# EAGLE design charger_4012 (EAGLE 7.5.0)
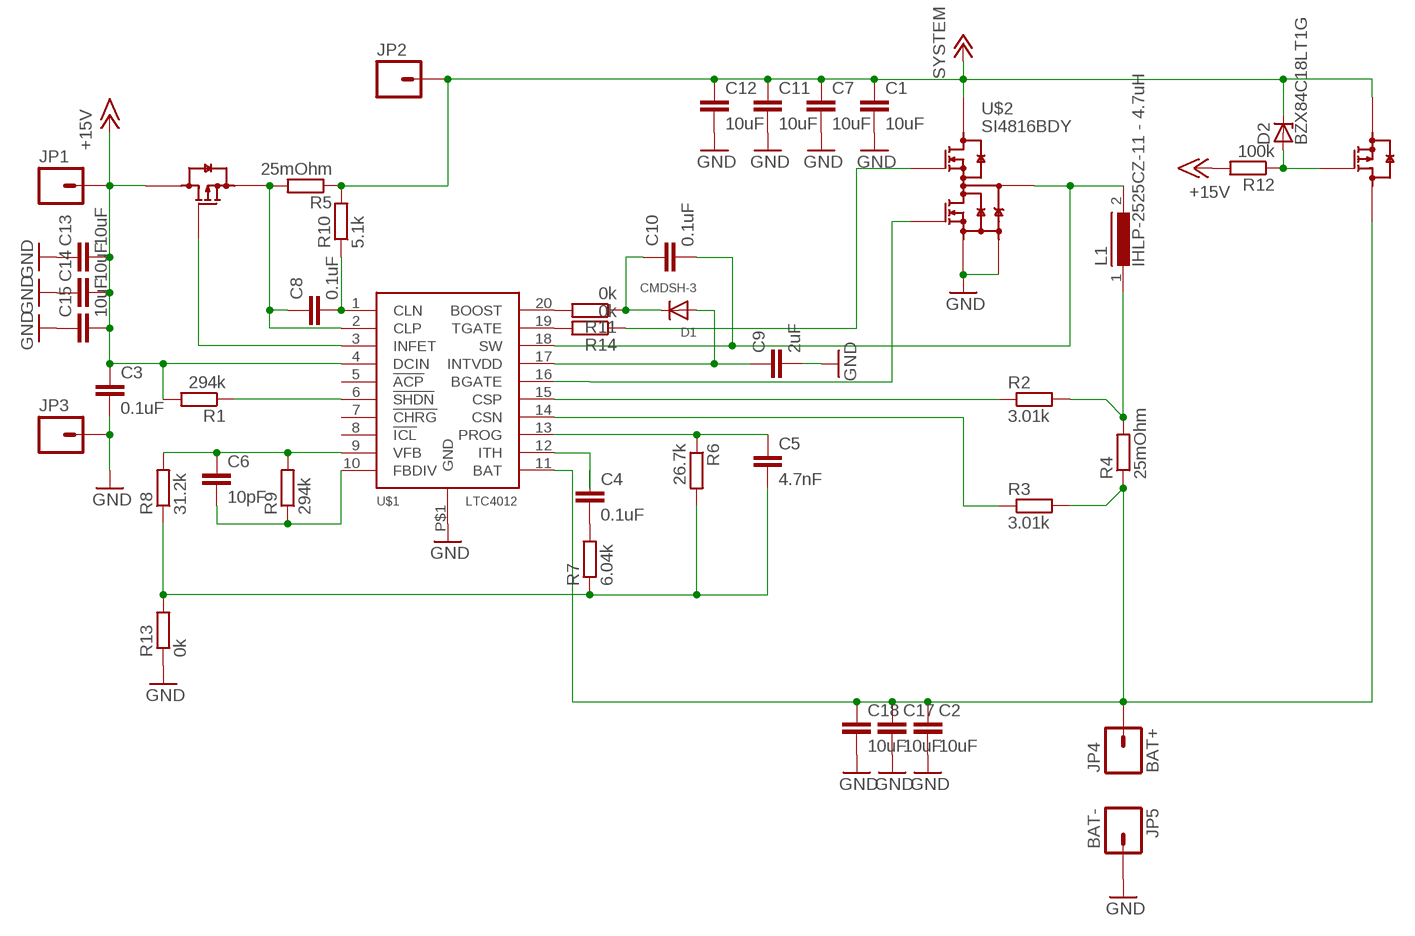
[diagram p0: schematic, sheet 1]

## Parts
C1  10uF  C-EUC1206  [C1206]
C2  10uF  C-EUC1206  [C1206]
C3  0.1uF  C-EUC0402  [C0402]
C4  0.1uF  C-EUC0402  [C0402]
C5  4.7nF  C-EUC0402  [C0402]
C6  10pF  C-EUC0402  [C0402]
C7  10uF  C-EUC1206  [C1206]
C8  0.1uF  C-EUC0402  [C0402]
C9  2uF  C-EUC0805  [C0805]
C10  0.1uF  C-EUC0402  [C0402]
C11  10uF  C-EUC1206  [C1206]
C12  10uF  C-EUC1206  [C1206]
C13  10uF  C-EUC1206  [C1206]
C14  10uF  C-EUC1206  [C1206]
C15  10uF  C-EUC1206  [C1206]
C17  10uF  C-EUC1206  [C1206]
C18  10uF  C-EUC1206  [C1206]
D1  CMDSH-3  DIODESOD-323F  [SOD-323F]
D2  BZX84C18LT1G  ZENER-DIODETO236  [TO236]
JP1  M01PTH_2MM  [1X01_2MM]
JP2  M01PTH_2MM  [1X01_2MM]
JP3  M01PTH_2MM  [1X01_2MM]
JP4  BAT+  M01PTH_2MM  [1X01_2MM]
JP5  BAT-  M01PTH_2MM  [1X01_2MM]
L1  IHLP-2525CZ-11 - 4.7uH  DR73  [DR73]
R1  294k  R-EU_R0402  [R0402]
R2  3.01k  R-EU_R0402  [R0402]
R3  3.01k  R-EU_R0402  [R0402]
R4  25mOhm  R-EU_R2512  [R2512]
R5  25mOhm  R-EU_R2512  [R2512]
R6  26.7k  R-EU_R0402  [R0402]
R7  6.04k  R-EU_R0402  [R0402]
R8  31.2k  R-EU_R0402  [R0402]
R9  294k  R-EU_R0402  [R0402]
R10  5.1k  R-EU_R0402  [R0402]
R11  0k  R-EU_R0402  [R0402]
R12  100k  R-EU_R0402  [R0402]
R13  0k  R-EU_R0402  [R0402]
R14  0k  R-EU_R0402  [R0402]
U$1  LTC4012  [QFN20]
U$2  SI4816BDY  [SO-8]
U$3  SI7423DN  [POWERPACK1212]
U$4  SI7423DN  [POWERPACK1212]

## Nets
+12V: C1.1 C7.1 C11.1 C12.1 D2.C JP2.1 R5.1 R10.2 U$2.8(D1) U$4.1(S) U$4.2(S) U$4.3(S) ; supply symbol labelled SYSTEM
+15V: C3.1 C13.2 C14.2 C15.2 JP1.1 R1.2 R12.2 U$1.4(DCIN) U$3.5(D) U$3.6(D) U$3.7(D) U$3.8(D) U$3.9(D)
BAT: C2.1 C17.1 C18.1 JP4.1 R3.2 R4.1 U$1.11(BAT) U$4.5(D) U$4.6(D) U$4.7(D) U$4.8(D) U$4.9(D)
BGATE: U$1.16(BGATE) U$2.4(G2)
BOOST: C10.1 D1.C R11.1
CLN: C8.2 R10.1 U$1.1(CLN)
CSN: R3.1 U$1.14(CSN)
CSP: R2.1 U$1.15(CSP)
FBDIV: C6.2 R9.1 U$1.10(FBDIV)
GND: C1.2 C2.2 C3.2 C7.2 C9.2 C11.2 C12.2 C13.1 C14.1 C15.1 C17.2 C18.2 JP3.1 JP5.1 R13.1 U$1.P$1(GND) U$2.2(A) U$2.3(S2)
INFET: U$1.3(INFET) U$3.4(G)
INTVDD: C9.1 D1.A U$1.17(INTVDD)
ITH: C4.1 U$1.12(ITH)
N$1: R14.2 U$1.19(TGATE)
N$3: L1.1 R2.2 R4.2
N$7: C4.2 R7.2
N$8: R1.1 U$1.6(!SHDN)
N$15: C8.1 R5.2 U$1.2(CLP) U$3.1(S) U$3.2(S) U$3.3(S)
N$18: R11.2 U$1.20(BOOST)
N$20: D2.A R12.1 U$4.4(G)
PROG: C5.1 R6.1 U$1.13(PROG)
SGND: C5.2 R6.2 R7.1 R8.1 R13.2
SW: C10.2 L1.2 U$1.18(SW) U$2.5(S1/D2) U$2.6(S1/D2) U$2.7(S1/D2)
TGATE: R14.1 U$2.1(G1)
VFB: C6.1 R8.2 R9.2 U$1.9(VFB)
Unconnected: U$1.5(!ACP) U$1.7(!CHRG) U$1.8(!ICL)

## Library data of the parts
C1-C15 C17 C18 = resistor:C-EU: CAPACITOR, European symbol
D1 = adafruit:DIODE: Diode SMADIODE - SMA Surface Mount Package 20V 1A Schottky Diode Digikey: 641-1014-6-ND DO-1N4148 - Through Hole Small Current Diode SOD-123 20V 1 A (.5mV Vf) Schottky Diode - Digikey: MBRX120TPMSCT-ND SOD-323 10V 570mA (.38mV Vf, 3ns) Schottky Diode - Digikey: ZLLS410CT-ND SOD-523 30V 30mA Schottky Diode (RB751S-40TE61) - Digikey: RB751S-40TE61CT-ND SOT23-R/W - SOT23 Package (R = Solder Paste/Reflow Ovens, W = Hand-Soldering) BAT54Film 40V 300mA - Digikey: 497-7162-1-ND
D2 = diode:ZENER-DIODE: Z-Diode
JP1-JP5 = SparkFun-Connectors:M01: Header 1 Standard 1-pin 0.1" header. Use with straight break away headers (SKU : PRT-00116), right angle break away headers (PRT-00553), swiss pins (PRT-00743), machine pins (PRT-00117), and female headers (PRT-00115).
L1 = inductors:DR73: High Power Density, High Efficiency, Shielded Inductors Source: coiltronics_dr_series.pdf
R1-R14 = resistor:R-EU_: RESISTOR, European symbol
U$1 = ltc4012:LTC4012
U$2 = vishay:SI4816BDY
U$3 U$4 = vishay:SI7423DN

## Net classes
0 default: width 0.25 mm, drill 0.5 mm, clearance 0.15 mm

## Board
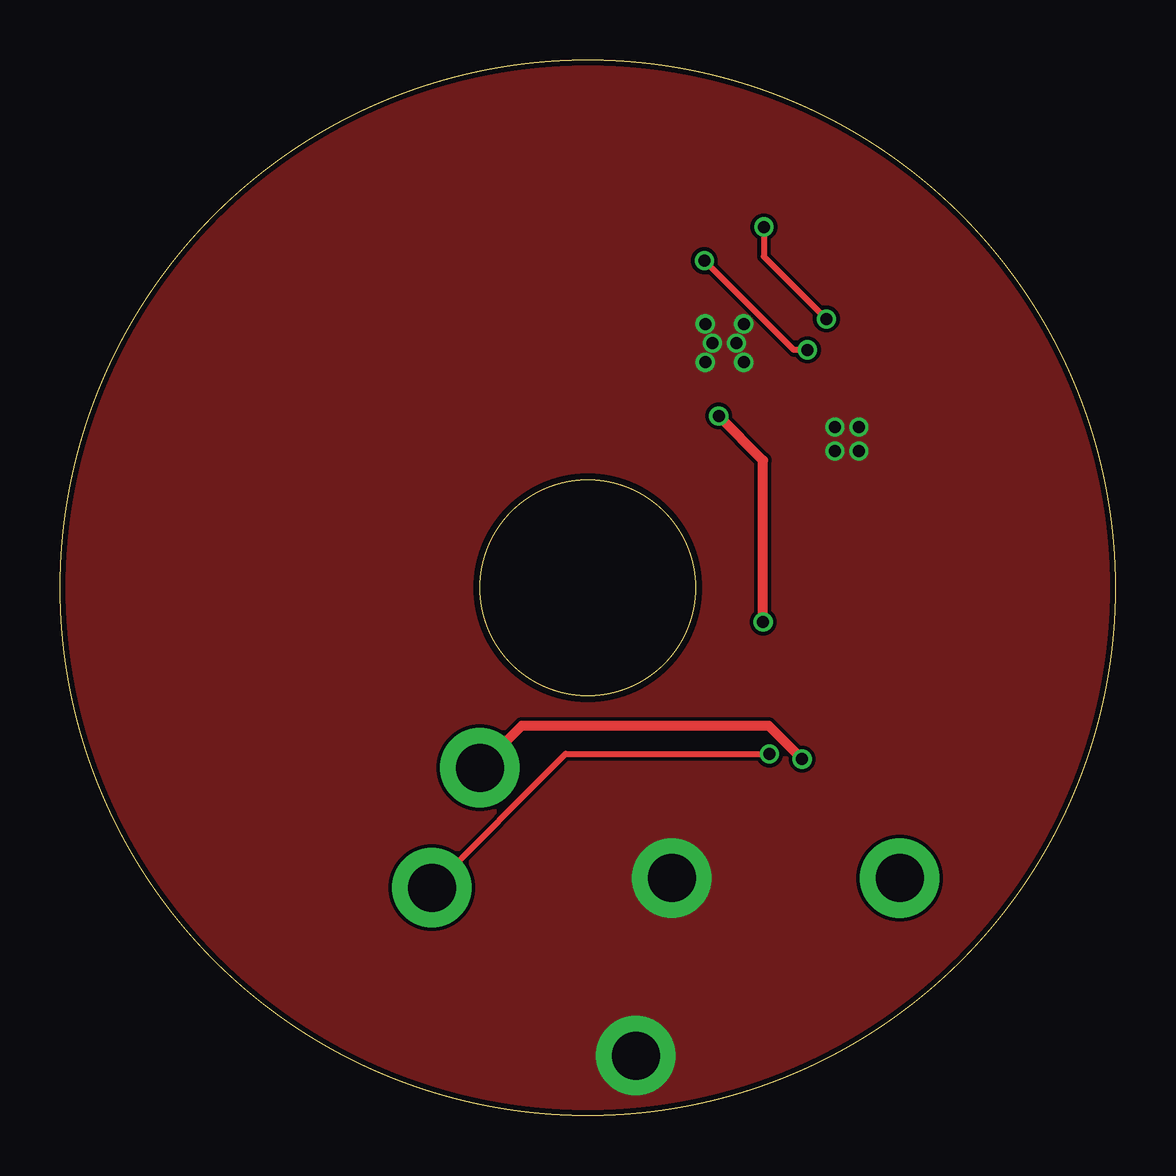
[diagram p1: board, top side]
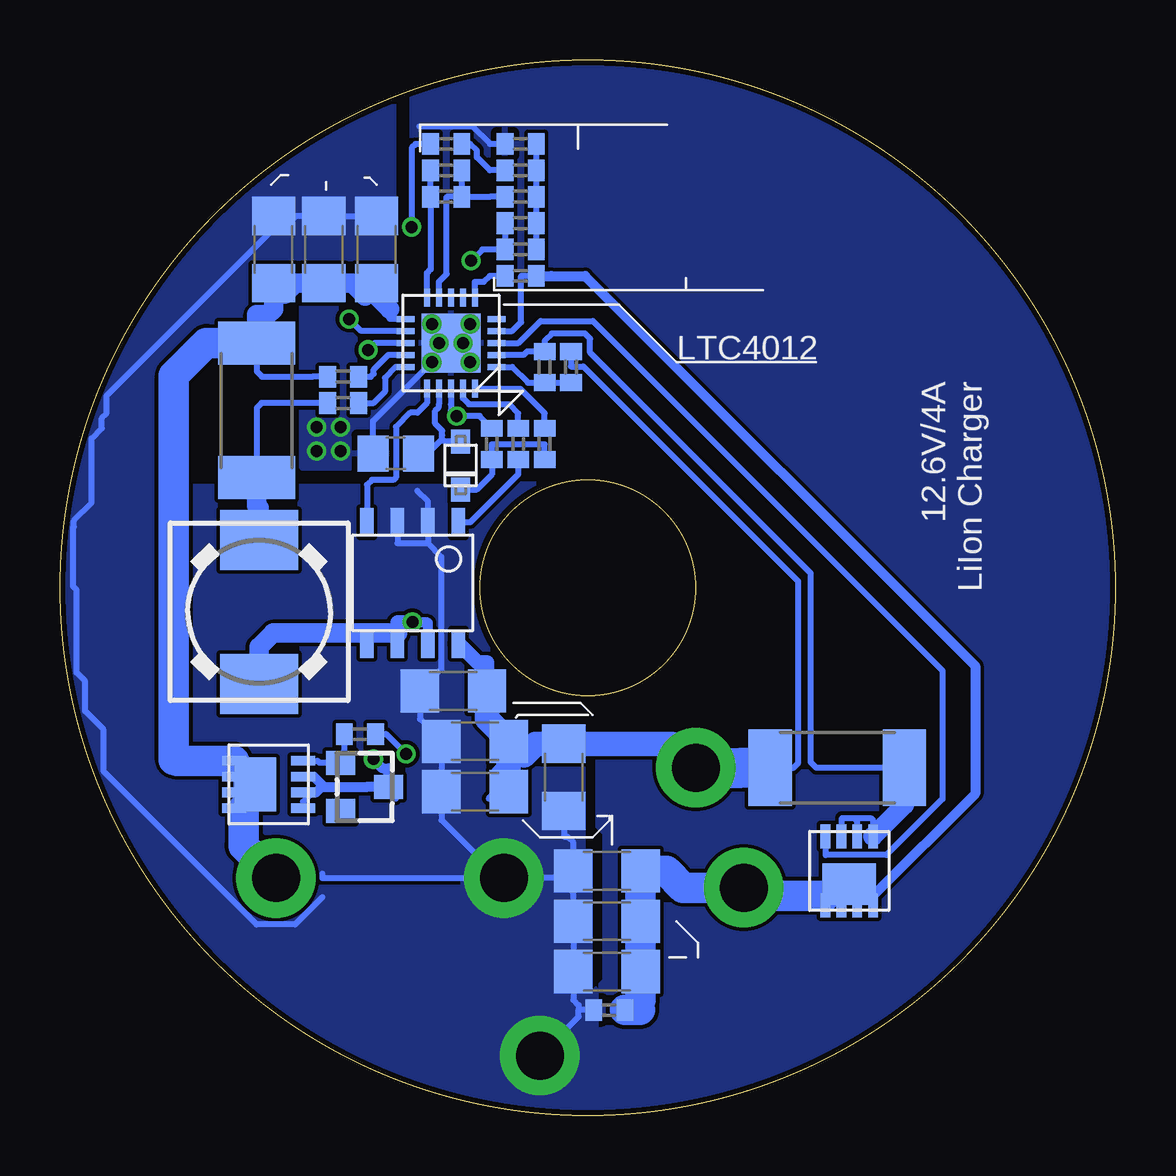
[diagram p2: board, bottom side, seen from below]

Size 44 x 44 mm. Coordinates in mm from the lower left corner, seen from the top.
Outline: circle at 22,22 radius 22
Outline: circle at 22,22 radius 4.5
Copper layers (1*16): Top 0.035mm / dielectric 1.5mm / Bottom 0.035mm
Design rules "SeeedStudio_2layer_DRU_no_angle_20140221": minimum track width 6mil, minimum drill 12mil, track to track 6mil, track to pad 6mil, pad to pad 6mil, via to via 6mil, smd to smd 0mil, copper to edge 10mil, drill to drill 10mil, minimum pad ring 10mil, minimum via ring 6mil, stop-mask expansion 2mil, vias tented up to drill 100mil, thermal gap 10mil

### Footprints (pad centres in the part's own frame; a part is rotated, then mirrored left to right if it is on the bottom)
C1206 = smd 1.6 x 1.8: 1 -1.4,0; 2 1.4,0
C0402 = smd 0.7 x 0.9: 1 -0.65,0; 2 0.65,0
C0805 = smd 1.3 x 1.5: 1 -0.95,0; 2 0.95,0
SOD-323F = smd 1 x 0.8: A -1,0; C 1,0
TO236 = smd 1 x 1.2: A -1,-1; C 0,1; NC 1,-1
1X01_2MM = drill 2 pad 3.302: 1 0,0
DR73 = smd 2.5 x 3.25: 1 -3,0; 2 3,0
R0402 = smd 0.7 x 0.9: 1 -0.65,0; 2 0.65,0
R2512 = smd 1.8 x 3.2: 1 -2.8,0; 2 2.8,0
QFN20 = smd 0.75 x 0.25: 1 -1.9,1; 2 -1.9,0.5; 3 -1.9,0; 4 -1.9,-0.5; 5 -1.9,-1; 11 1.9,-1; 12 1.9,-0.5; 13 1.9,0; 14 1.9,0.5; 15 1.9,1 | smd 0.25 x 0.75: 6 -1,-1.9; 7 -0.5,-1.9; 8 0,-1.9; 9 0.5,-1.9; 10 1,-1.9; 16 1,1.9; 17 0.5,1.9; 18 0,1.9; 19 -0.5,1.9; 20 -1,1.9 | smd 2.45 x 2.45: P$1 0,0
SO-8 = smd 1.194 x 0.559: 1 -2.53,1.905; 2 -2.53,0.635; 3 -2.53,-0.635; 4 -2.53,-1.905; 5 2.53,-1.905; 6 2.53,-0.635; 7 2.53,0.635; 8 2.53,1.905
POWERPACK1212 = smd 1 x 0.405: 1 -1.435,0.99; 2 -1.435,0.33; 3 -1.435,-0.33; 4 -1.435,-0.99; 5 1.435,-0.99; 6 1.435,-0.33; 7 1.435,0.33; 8 1.435,0.99 | smd 1.725 x 2.235: 9 0.56,0

### Placement (x,y rotation side)
C1  23,14.1 270 bottom
C2  35.1,36.1 90 bottom
C3  21.1,4.4 180 bottom
C4  27.9,40.5 0 bottom
C5  24.8,36.1 0 bottom
C6  27.9,39.4 180 bottom
C7  26.7,13.5 180 bottom
C8  23.8,31.2 270 bottom
C9  30,27.6 180 bottom
C10  26,28 90 bottom
C11  26.7,15.6 180 bottom
C12  27.6,17.7 180 bottom
C13  21.2,10.2 0 bottom
C14  21.2,8.1 0 bottom
C15  21.2,6 0 bottom
C17  33,36.1 90 bottom
C18  30.8,36.1 90 bottom
D1  27.3,27.1 270 bottom
D2  31.3,13.7 270 bottom
JP1  15.5,9.5 0 top
JP2  17.5,14.5 0 top
JP3  24,2.5 0 top
JP4  35,9.9 0 top
JP5  25.5,9.9 0 top
L1  35.7,21 270 bottom
R1  24.8,35 0 bottom
R2  32.2,29.7 180 bottom
R3  32.2,30.8 180 bottom
R4  35.8,29.4 270 bottom
R5  11.6,14.5 0 bottom
R6  24.8,37.2 0 bottom
R7  24.8,39.4 180 bottom
R8  24.8,38.3 180 bottom
R9  27.9,38.3 0 bottom
R10  22.7,31.2 90 bottom
R11  23.8,28 90 bottom
R12  31.5,15.9 0 bottom
R13  24.8,40.5 0 bottom
R14  24.9,28 90 bottom
U$1  27.7,32.2 180 bottom
U$2  29.3,22.2 270 bottom
U$3  11.1,10.2 270 bottom
U$4  35.3,13.8 180 bottom

### Tracks (layer width: path | path; a pad name or v marks a point on that pad's centre or on a via)
+12V  (via drill 0.5 pad 0.61)
  Top 0.406: JP2.1 19.26,16.26 29.54,16.26 v30.93,14.86
  Bottom 0.25: 26.13,13.21 25.84,13.5 25.59,13.5 25.57,13.5 C7.1 | 30,13.21 30.49,13.7 D2.C | R5.1 13.43,14.5 13.22,14.7 13.22,22.27 22.18,31.22 22.7,31.22 R10.2 | 18.31,15.69 18.5,15.5 | 24.67,15.01 25.3,15.01 C11.1 25.3,15.62 | U$4.3 33.42,14.13 | 33.09,13.79 33.09,13.7 | U$4.1 33.87,13.08 33.48,13.47 U$4.2
  Bottom 0.406: D2.C 30.3,14.48 30.55,14.48 v30.93,14.86 | 30.49,13.7 31.18,13.7 33.09,13.7 33.32,13.47 33.48,13.47 | 33.42,14.13 33.09,13.79 | JP2.1 18.5,15.5
  Bottom 0.61: 25.57,13.5 25.57,14.15 | C12.1 26.2,18.88 26.6,18.88 U$2.8
  Bottom 1.016: 24.67,15.01 24.18,15.5 C1.1 21.82,15.5 18.5,15.5 | 25.3,15.01 25.3,14.42 25.57,14.15 | C12.1 26.2,16.52 25.3,15.62
  Bottom 1.676: JP2.1 15.58,14.5 R5.1
+15V  (via drill 0.5 pad 0.61)
  Top 0.25: JP1.1 21.07,15.07 v29.57,15.07
  Bottom 0.25: 30.42,15.9 30.4,15.9 | 30.4,15.9 v29.57,15.07 | 11.43,9.15 11.43,9.54 11.2,9.54 U$3.9 10.83,9.37 10.77,9.37 | U$3.6 11.43,9.15 | 11.43,9.15 12.09,9.15 U$3.5 | R12.2 30.42,15.9 | 30.42,15.9 30.4,15.9 | 30.4,15.9 30.42,15.9 | 19.8,4.82 19.82,4.8 19.82,4.4 | 10.77,9.37 10.6,9.54 10.11,9.54 10.11,9.15 U$3.8 | 10.77,9.37 10.77,9.15 U$3.7 | R1.2 24.78,35 24.78,33.07 25.15,32.7 U$1.4
  Bottom 0.406: 10.11,9.15 5.85,13.41 5.85,18.74 22.11,35 23.52,35 R1.2
  Bottom 1.27: C3.1 19.82,4.4 | 19.8,4.82 C15.2 C14.2 C13.2 18.72,10.2 18.02,9.5 JP1.1 15.15,9.15 12.09,9.15
BAT
  Bottom 0.25: 36.35,14.13 36.29,14.13 35.96,14.47 35.96,14.79 U$4.5 | 36.64,14.13 U$4.6 | R3.2 33.48,30.8 35.58,30.8 35.8,31.02 R4.1 | 34.63,34.25 35.1,34.25 C2.1 | 36.35,14.13 36.19,14.13 U$4.9 | 36.64,14.13 36.35,14.13 | 36.64,13.47 36.54,13.47 36.54,12.81 | U$4.7 36.64,13.47 | 36.64,13.47 36.64,14.13 | 36.54,12.81 36.35,12.81 | U$4.8 36.54,12.81 | U$1.11 30.25,33.2 30.25,33.61 | 31.28,34.16 30.8,34.16 C18.1
  Bottom 0.813: 34.63,34.25 34.18,34.7 C17.1 31.82,34.7 31.28,34.16 | 35.1,34.25 35.1,33.62 35.34,33.38 35.8,33.38 R4.1 | 30.25,33.61 30.8,34.16
  Bottom 1.27: U$4.5 39.11,14.79 39.26,14.83 39.26,29.9 39.26,30.84 37.9,32.2 R4.1 | 36.35,12.81 36.35,11.25 JP4.1
BGATE
  Bottom 0.25: U$1.16 28.7,29.7 29.1,29.3 29.4,29.3 30,28.7 30,26.6 30.1,26.5 31,26.5 31.2,26.3 U$2.4
BOOST
  Bottom 0.25: D1.C 26.62,26.1 26,26.72 C10.1 26,27.98 23.8,27.98 R11.1
CLN
  Bottom 0.25: R10.1 C8.2 24.5,30.55 25.15,31.2 U$1.1
CSN
  Bottom 0.25: R3.1 31.05,30.8 30.92,30.93 30.92,31.1 30.32,31.7 30.25,31.7 U$1.14
CSP
  Bottom 0.25: R2.1 30.92,29.7 30.45,30.17 30.45,30.75 30,31.2 U$1.15
FBDIV
  Bottom 0.25: U$1.10 28.7,35.12 28.55,35.27 28.55,37.94 R9.1 C6.2
GND  (via drill 0.5 pad 0.61)
  Bottom 0.25: 33.07,9.1 34.2,7.97 35.8,7.97 42.18,14.35 42.18,16.09 42.95,16.86 42.95,18.11 43.31,18.47 43.31,21.91 43.45,22.05 43.45,24.51 43.42,24.54 43.42,24.8 42.68,25.54 42.68,28.23 42.26,28.65 42.26,29.07 42.06,29.26 42.06,30 35.1,36.96 | JP5.1 25.68,9.9 28.1,12.32 C7.2 C11.2 28.1,15.62 29,16.52 29,17.11 | 33.07,10.09 33.07,9.9 JP5.1 | 29,17.11 29.45,17.11 | 29,17.11 C12.2 28.11,18.59 28.11,23.3 28.66,23.86 | 35.1,36.96 34.72,36.96 34.18,37.5 C17.2 C18.2 | 22.87,9.9 22.87,9.93 C13.1 22.6,11.38 22.84,11.62 23,11.62 C1.2 | 22.87,9.9 22.87,9.55 22.6,9.28 C14.1 C15.1 22.6,4.82 22.38,4.6 22.38,4.4 | 22.87,9.9 JP5.1 | C2.2 35.1,36.96 | R13.1 26.08,40.5 26.08,40.52 26.78,41.23 29.02,41.23 | JP3.1 22.38,4.12 22.38,4.4 | C3.2 22.38,4.4 | 29.1,26.04 28.66,25.6 U$2.2 28.66,23.86 | 28.66,23.86 29.93,23.86 U$2.3 | C9.2 30.95,28.95 U$1.P$1
  other vias: 32.3,28.7 33.3,28.7 32.3,27.7 33.3,27.7 26.9,33 28.5,33 26.9,31.4 28.5,31.4 27.2,32.2 28.2,32.2
  pour Bottom (no thermals): 26.9,26.2 38.7,26.2 38.7,15.08 33.72,10.13 22.2,10.1 22.2,26.3 26.9,26.3
  pour Bottom: 23.4,27 33.9,27 33.9,35.2 33.8,35.3 29.8,35.3 29.3,35.8 29.3,42.2 29.3,43.4 29,43.7 27.9,43.7 27.2,44.4 23.3,44.4 23.3,27.1
  pour Bottom (no thermals): 30.1,43.1 51,43.1 51,-0.1 21.9,-0.1 21.9,11 27.2,11 27.2,9.5 35.6,9.5 37.2,11.1 37.2,14.2 37.8,14.8 38.6,14.8 39.6,15.8 39.6,30.6 37.9,32.3 36.6,32.3 34.3,34.6 30.7,34.6 30.1,35.2
  pour Bottom: -4.9,-1.3 -4.9,30.6 13,48.5 23.3,48.5 23.7,48.1 23.7,20.2 21.5,18 21.5,12.1 21.2,11.8 21.2,5.6 22.1,4.7 22.1,-0.5 22,-0.6 -1.4,-0.6 -2.2,-1.4 -4.8,-1.4
  pour Top (no thermals): -0.9,44.6 45.1,44.6 45.1,0.3 45.1,0 -0.9,0
INFET
  Bottom 0.25: U$1.3 24.89,32.2 23.97,33.12 21.79,33.12 7.21,18.55 7.21,13.19 9.55,10.86 12.09,10.86 U$3.4
INTVDD
  Bottom 0.25: U$1.17 28.2,29.65 28.2,29.54 28.36,29.38 28.36,28.83 28.07,28.55 28.07,28.35 28.07,28.2 | 28.07,28.2 27.98,28.1 D1.A | C9.1 28.67,27.6 28.07,28.2
ITH  (via drill 0.5 pad 0.61)
  Top 0.25: v29.34,37.04 29.34,35.81 v31.95,33.2
  Bottom 0.25: v31.95,33.2 31.45,32.7 30.25,32.7 U$1.12 | v29.34,37.04 29.34,40.34 29.18,40.5 C4.1
N$1
  Bottom 0.25: U$1.19 27.2,29.9 26.95,29.65 25.27,29.65 24.9,29.28 R14.2
N$3
  Bottom 0.25: R2.2 35.6,29.7 35.8,29.5 R4.2
  Bottom 0.813: R4.2 35.8,25.42 35.7,25.32 L1.1
N$7
  Bottom 0.25: C4.2 26.89,40.5 26.62,40.23 26.62,39.95 26.08,39.4 R7.2
N$8
  Bottom 0.25: R1.1 26.08,35 26.32,34.75 26.7,34.75 U$1.6
N$15
  Bottom 0.25: U$1.2 24.68,31.7 24.53,31.85 C8.1 23.8,32.3 23.5,32.6 22.4,32.6 22.12,32.6 21.9,32.38 21.9,31.8 12.7,22.6 12.7,14.72 12.48,14.5 R5.2 8.8,12.95 | U$3.1 10.1,11.64 10.1,12.3 10.2,12.4 10.9,12.4 | U$3.3 11.4,11.66 11.4,12.4 10.9,12.4 | U$3.2 10.77,12.27 10.9,12.4
  Bottom 0.813: U$3.1 8.8,12.95
N$18
  Bottom 0.25: R11.2 23.8,29.28 24.82,30.3 U$1.20
N$20
  Bottom 0.25: R12.1 32.15,15.17 32.3,15.02 D2.A 33.18,14.7 33.27,14.79 U$4.4
PROG  (via drill 0.5 pad 0.61)
  Top 0.25: v31.16,31.91 30.58,31.91 v26.86,35.63
  Bottom 0.25: v26.86,35.63 26.4,36.1 26.08,36.1 C5.1 R6.1 | U$1.13 30.87,32.2 v31.16,31.91
SGND
  Bottom 0.25: C5.2 R6.2 R8.1 R7.1 R13.2
SW  (via drill 0.5 pad 0.61)
  Top 0.406: v29.31,20.57 29.31,27.31 v27.46,29.16
  Bottom 0.25: C10.2 26.51,29.16 v27.46,29.16 27.7,29.4 27.7,29.65 U$1.18 | 29.31,20.54 v29.31,20.57 | U$2.6 29.93,20.11 | U$2.5 31.2,20.11
  Bottom 0.406: 29.31,20.54 28.66,20.54 U$2.7
  Bottom 0.61: 29.31,20.54 29.93,20.54 29.93,20.11
  Bottom 0.813: 29.93,20.11 31.2,20.11 35.12,20.11 35.7,19.53 L1.2
TGATE
  Bottom 0.25: R14.1 24.9,26.72 26.89,24.73 U$2.1
VFB
  Bottom 0.25: R9.2 27.88,38.3 27.88,35.08 28.2,34.75 U$1.9 | R9.2 26.08,38.3 R8.2 | R9.2 C6.1

### Text on the board
bNames: 12.6V/4A / LiIon Charger